# EAGLE design ventmon_t0.4 (EAGLE 9.6.2)

## Sheet 1 of 2
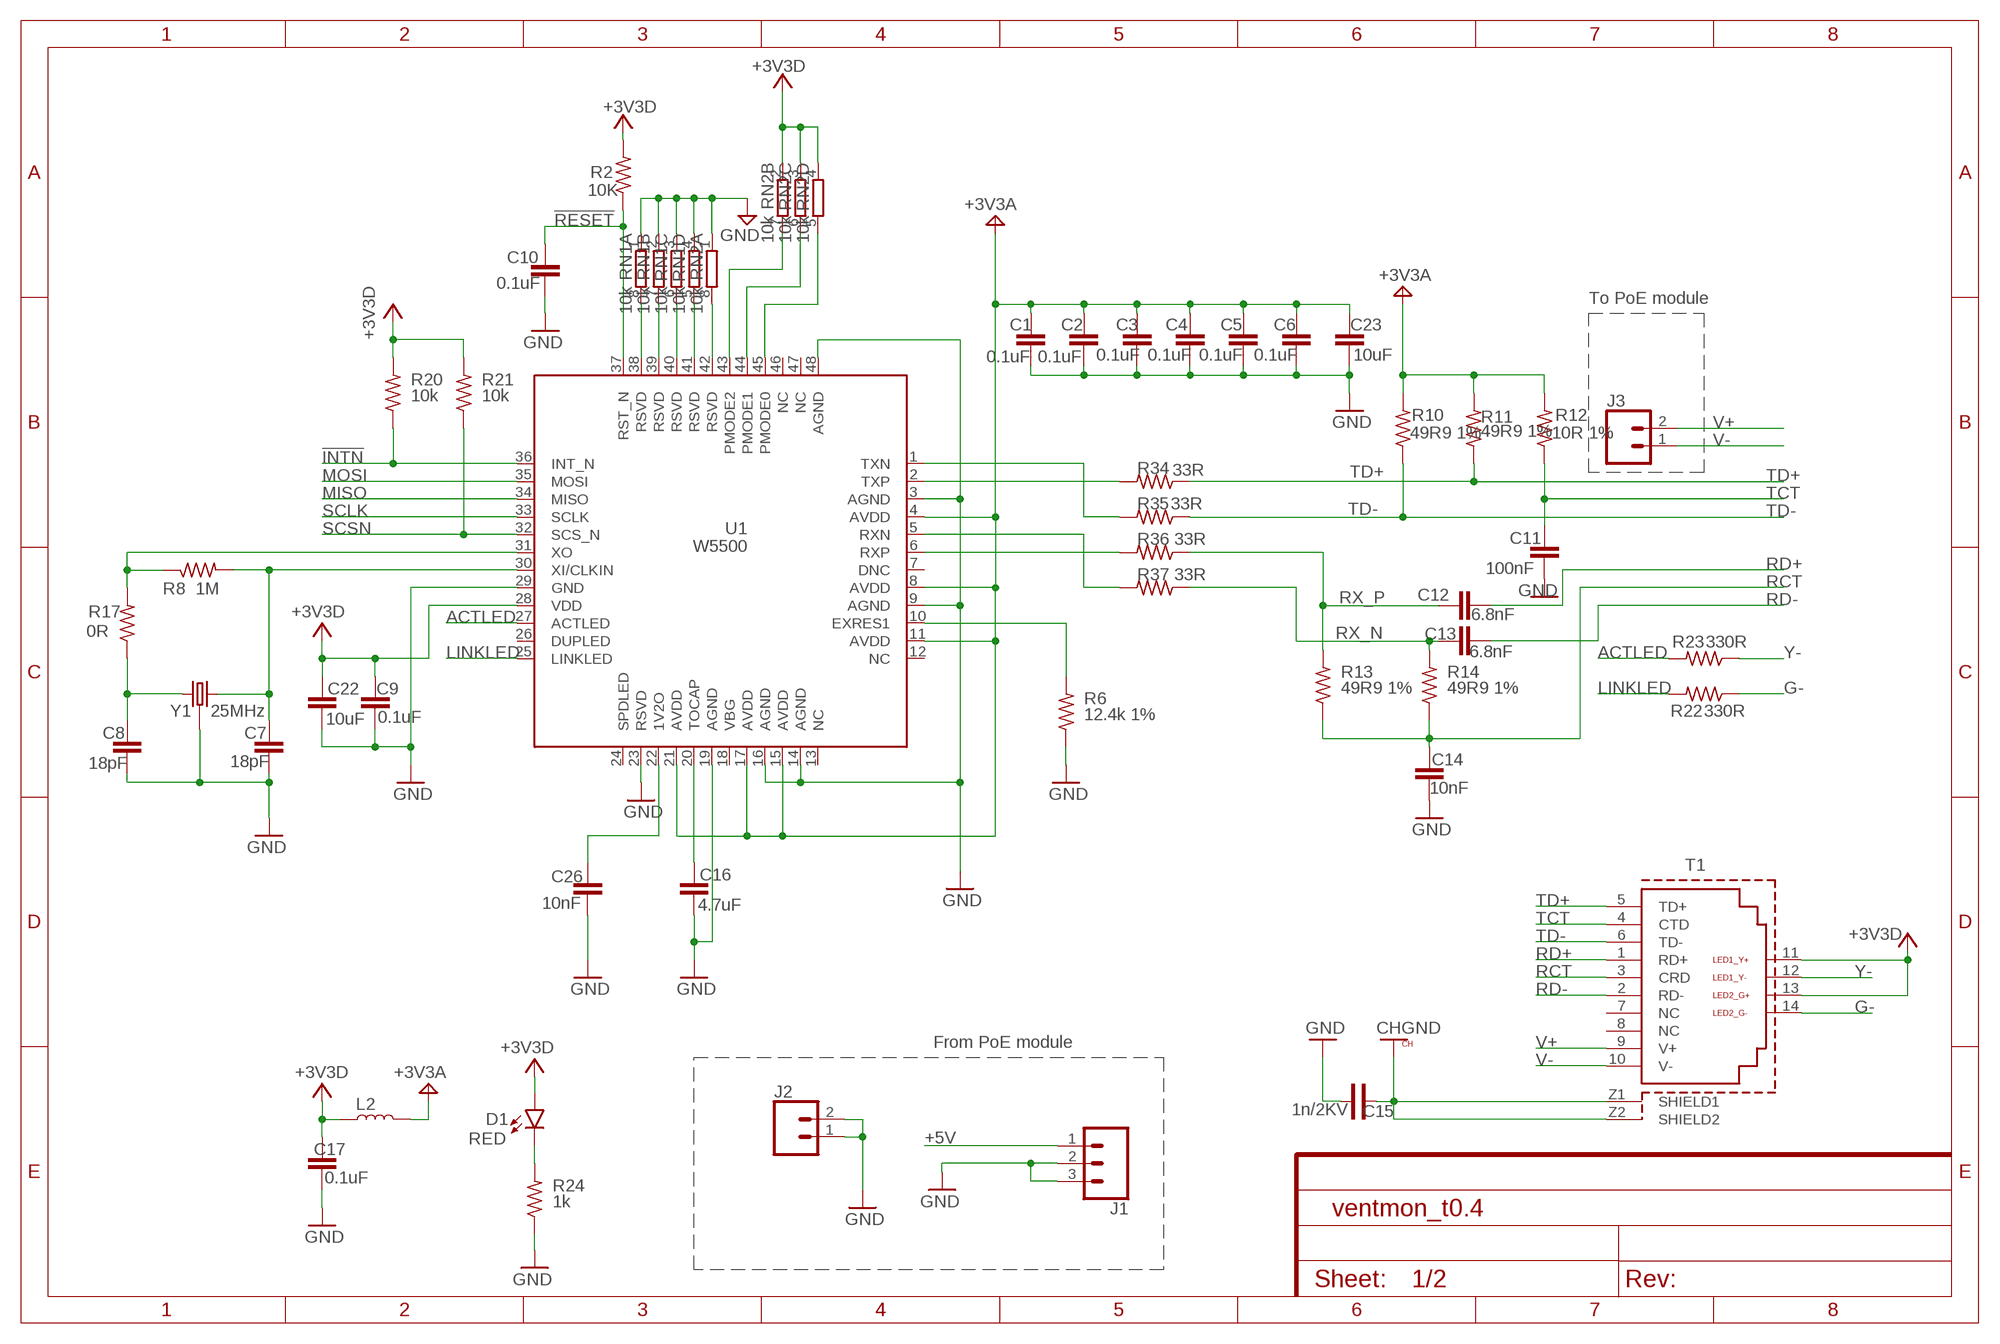
[diagram p0: schematic, sheet 1]

### Parts
C1  0.1uF  CAP_1  [C0402_B]
C2  0.1uF  CAP_1  [C0402_B]
C3  0.1uF  CAP_1  [C0402_B]
C4  0.1uF  CAP_1  [C0402_B]
C5  0.1uF  CAP_1  [C0402_B]
C6  0.1uF  CAP_1  [C0402_B]
C7  18pF  CAP_1  [C0402_B]
C8  18pF  CAP_1  [C0402_B]
C9  0.1uF  CAP_1  [C0402_B]
C10  0.1uF  CAP_1  [C0402_B]
C11  100nF  CAP_1  [C0402_B]
C12  6.8nF  CAP_1  [C0402_B]
C13  6.8nF  CAP_1  [C0402_B]
C14  10nF  CAP_1  [C0402_B]
C15  1n/2KV  C-1808  [C-1808]
C16  4.7uF  0.18UF-0603-10V-10%  [0603]
C17  0.1uF  CAP_1  [C0402_B]
C22  10uF  0.18UF-0603-10V-10%  [0603]
C23  10uF  0.18UF-0603-10V-10%  [0603]
C26  10nF  CAP_1  [C0402_B]
D1  RED  LED-RED0603  [LED-0603]
J1  CONN_03  [1X03]
J2  CONN_02  [1X02]
J3  CONN_02  [1X02]
L2  INDUCTOR-0805-3.3UH  [0805]
R2  10K  R-US_  [R0402_B]
R6  12.4k 1%  R-US_  [R0402_B]
R8  1M  R-US_  [R0402_B]
R10  49R9 1%  R-US_  [R0402_B]
R11  49R9 1%  R-US_  [R0402_B]
R12  10R 1%  R-US_  [R0402_B]
R13  49R9 1%  R-US_  [R0402_B]
R14  49R9 1%  R-US_  [R0402_B]
R17  0R  R-US_  [R0402_B]
R20  10k  R-US_  [R0402_B]
R21  10k  R-US_  [R0402_B]
R22  330R  R-US_  [R0402_B]
R23  330R  R-US_  [R0402_B]
R24  1k  R-US_  [R0402_B]
R34  33R  R-US_  [R0402_B]
R35  33R  R-US_  [R0402_B]
R36  33R  R-US_  [R0402_B]
R37  33R  R-US_  [R0402_B]
RN1  10k  4R-N0402ARV341  [4X0402ARV341]
RN2  10k  4R-N0402ARV341  [4X0402ARV341]
T1  WE-RJ45_7499210121A  [7499210121A]
U1  W5500  [W5500]
Y1  25MHz  CRYSTAL-GROUNDEDSMD-3.2X2.5  [CRYSTAL-SMD-3.2X2.5MM]

### Nets
!INTN: R20.1 U1.36(INT_N) ; also sheet 2
!RESET: C10.2 R2.1 U1.37(RST_N) ; also sheet 2
+3V3: C9.2 C17.2 C22.1 D1.A L2.1 R2.2 R20.2 R21.2 RN2.2 RN2.3 RN2.4 T1.11(LED1_Y+) T1.13(LED2_G+) U1.28(VDD) ; supply symbol labelled +3V3D ; also sheet 2
+3V3A: C1.2 C2.2 C3.2 C4.2 C5.2 C6.2 C23.1 L2.2 R10.2 R11.2 R12.2 U1.4(AVDD) U1.8(AVDD) U1.11(AVDD) U1.15(AVDD) U1.17(AVDD) U1.21(AVDD)
+5V: J1.1 ; also sheet 2
ACTLED: R23.2 U1.27(ACTLED)
CHGND: C15.P$1 T1.Z1(SHIELD1) T1.Z2(SHIELD2)
G-: R22.1 T1.14(LED2_G-)
GND: C1.1 C2.1 C3.1 C4.1 C5.1 C6.1 C7.1 C8.1 C9.1 C10.1 C11.1 C14.1 C15.P$2 C16.2 C17.1 C22.2 C23.2 C26.1 J1.2 J1.3 J2.1 J2.2 R6.1 R24.1 RN1.1 RN1.2 RN1.3 RN1.4 RN2.1 U1.3(AGND) U1.9(AGND) U1.14(AGND) U1.16(AGND) U1.19(AGND) U1.23(RSVD) U1.29(GND) U1.48(AGND) Y1.2 Y1.4 ; also sheet 2
LINKLED: R22.2 U1.25(LINKLED)
MISO: U1.34(MISO) ; also sheet 2
MOSI: U1.35(MOSI) ; also sheet 2
N$1: RN2.7 U1.43(PMODE2)
N$2: RN2.6 U1.44(PMODE1)
N$3: RN2.5 U1.45(PMODE0)
N$5: RN1.8 U1.38(RSVD)
N$6: RN1.7 U1.39(RSVD)
N$7: RN1.6 U1.40(RSVD)
N$8: RN1.5 U1.41(RSVD)
N$9: RN2.8 U1.42(RSVD)
N$11: C8.2 R17.1 Y1.1
N$12: C16.1 U1.20(TOCAP)
N$15: C26.2 U1.22(1V2O)
N$17: R6.2 U1.10(EXRES1)
N$20: D1.C R24.2
N$22: R8.1 R17.2 U1.31(XO)
N$29: C7.2 R8.2 U1.30(XI/CLKIN) Y1.3
R_N: R37.2 U1.5(RXN)
R_P: R36.2 U1.6(RXP)
RCT: C14.2 R13.1 R14.1 T1.3(CRD)
RD+: C12.2 T1.1(RD+)
RD-: C13.2 T1.2(RD-)
RX_N: C13.1 R14.2 R37.1
RX_P: C12.1 R13.2 R36.1
SCLK: U1.33(SCLK) ; also sheet 2
SCSN: R21.1 U1.32(SCS_N) ; also sheet 2
T_N: R35.2 U1.1(TXN)
T_P: R34.2 U1.2(TXP)
TCT: C11.2 R12.1 T1.4(CTD)
TD+: R11.1 R34.1 T1.5(TD+)
TD-: R10.1 R35.1 T1.6(TD-)
V+: J3.2 T1.9(V+)
V-: J3.1 T1.10(V-)
Y-: R23.1 T1.12(LED1_Y-)
Unconnected: T1.7(NC) T1.8(NC) U1.7(DNC) U1.12(NC) U1.13(NC) U1.18(VBG) U1.24(SPDLED) U1.26(DUPLED) U1.46(NC) U1.47(NC)

### Notes on the sheet
- To PoE module
- From PoE module

## Sheet 2 of 2
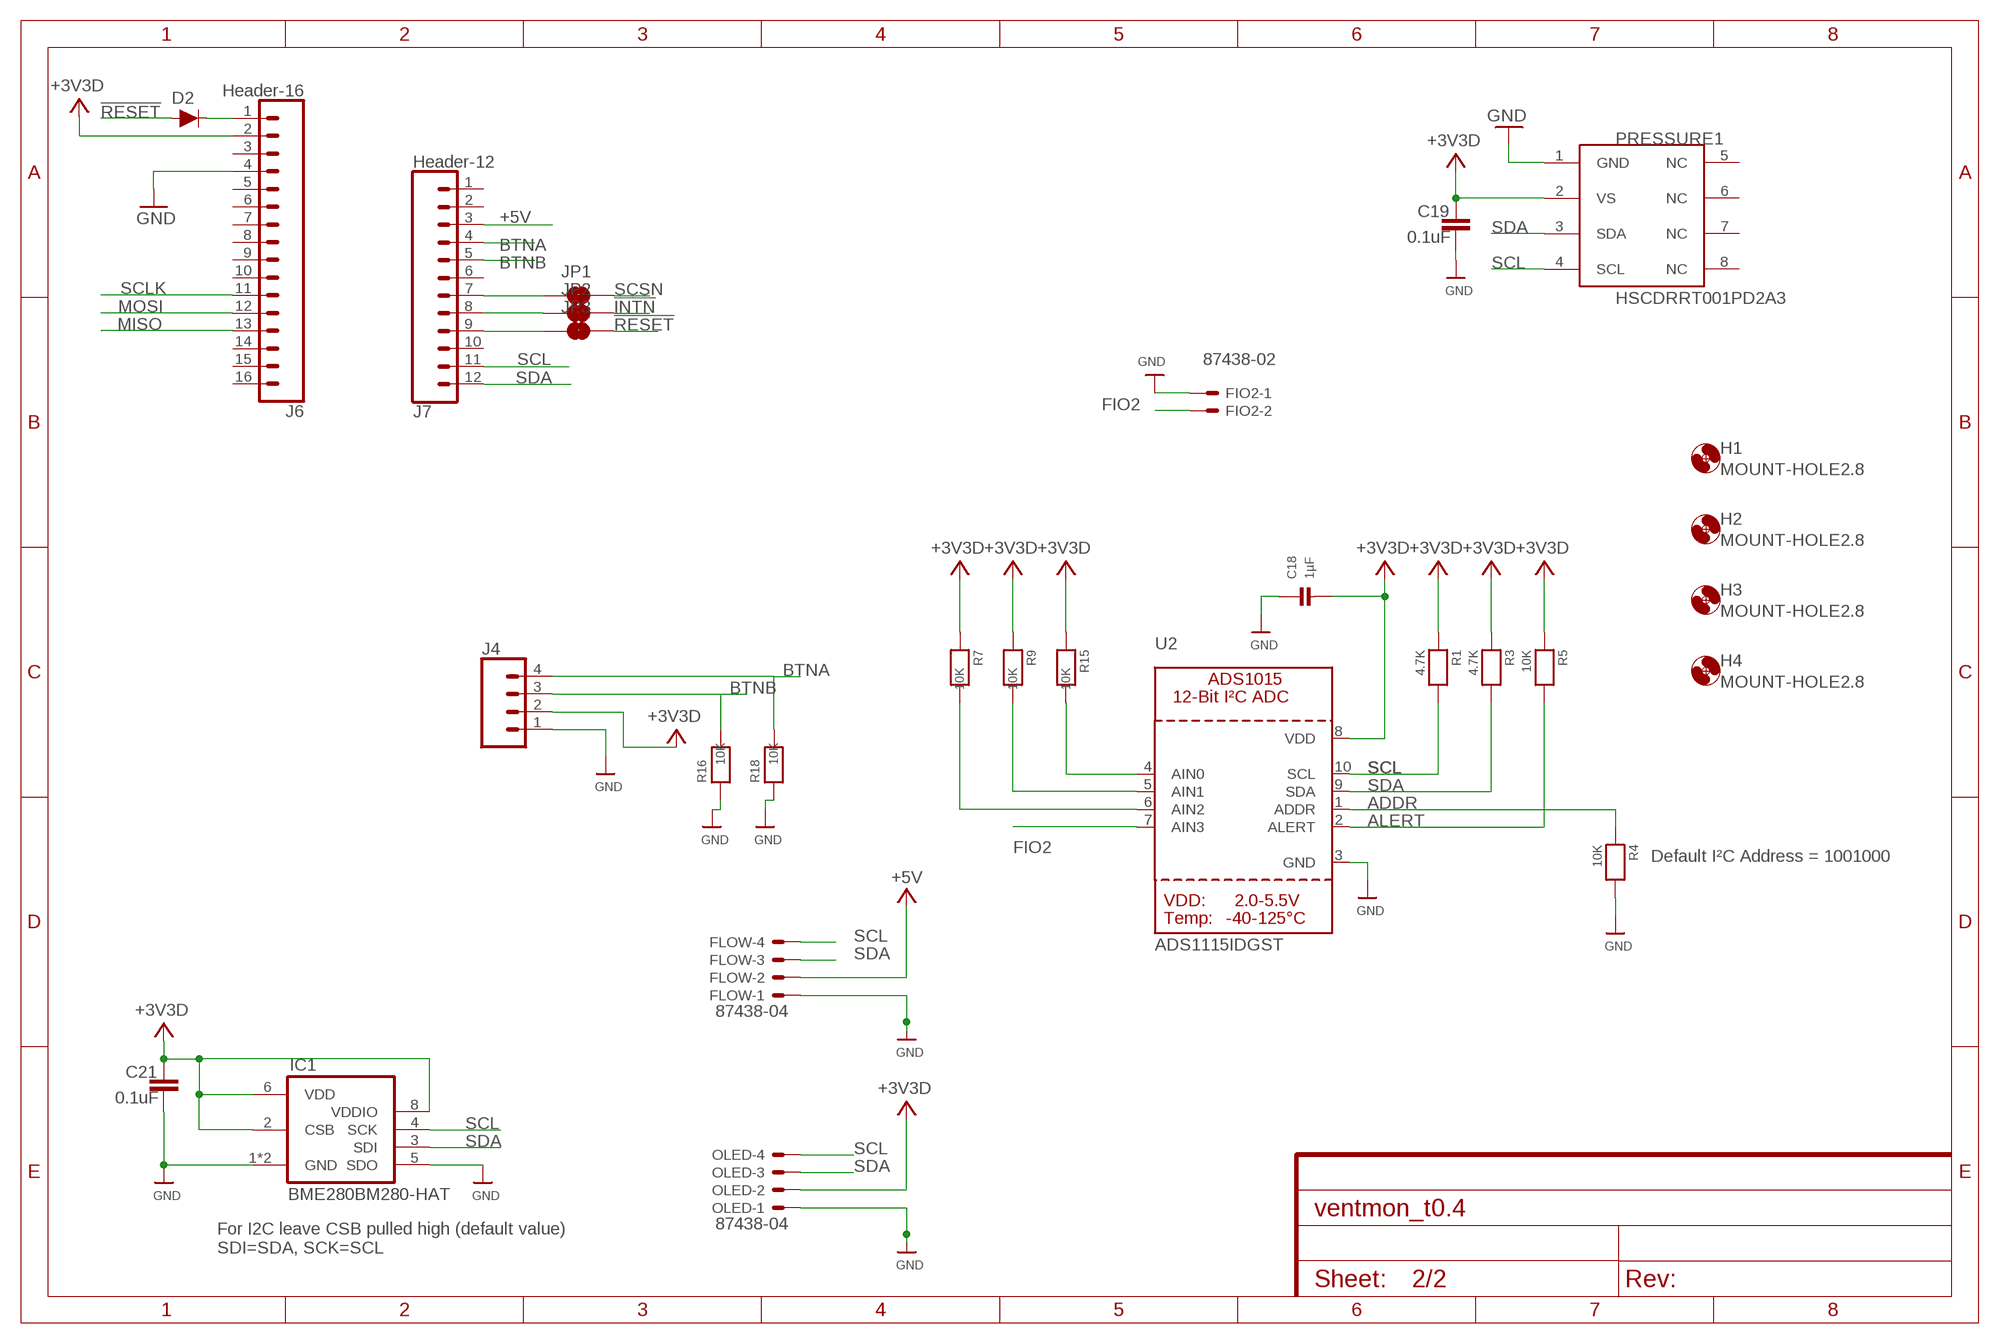
[diagram p1: schematic, sheet 2]

### Parts
C18  1µF  CAP_CERAMIC0805  [0805]
C19  0.1uF  CAP_1  [C0402_B]
C21  0.1uF  CAP_1  [C0402_B]
D2  DIODE-BAS16J  [SOD-323]
FIO2  87438-02  [87438-02]
FLOW  87438-04  [87438-04]
H1  MOUNT-HOLE2.8  [2,8]
H2  MOUNT-HOLE2.8  [2,8]
H3  MOUNT-HOLE2.8  [2,8]
H4  MOUNT-HOLE2.8  [2,8]
IC1  BME280BM280-HAT  [BME280-HAT]
J4  CONN_04POLAR  [MOLEX-1X4]
J6  Header-16  CONN_16  [1X16]
J7  Header-12  CONN_12  [1X12]
JP1  JUMPER-SMT_2_NC_TRACE_NO-SILK  [SMT-JUMPER_2_NC_TRACE_NO-SILK]
JP2  JUMPER-SMT_2_NC_TRACE_NO-SILK  [SMT-JUMPER_2_NC_TRACE_NO-SILK]
JP3  JUMPER-SMT_2_NC_TRACE_NO-SILK  [SMT-JUMPER_2_NC_TRACE_NO-SILK]
OLED  87438-04  [87438-04]
PRESSURE1  HSCDRRT001PD2A3  [DIP1330W46P254L1000H616Q8B]
R1  4.7K  RESISTOR0805  [0805]
R3  4.7K  RESISTOR0805  [0805]
R4  10K  RESISTOR0805  [0805]
R5  10K  RESISTOR0805  [0805]
R7  10K  RESISTOR0805  [0805]
R9  10K  RESISTOR0805  [0805]
R15  10K  RESISTOR0805  [0805]
R16  10K  RESISTOR0805  [0805]
R18  10K  RESISTOR0805  [0805]
U2  ADS1115IDGST  ADC_ADS1015  [MSOP10]

### Nets
!INTN: JP2.2 ; also sheet 1
!RESET: D2.A JP3.2 ; also sheet 1
+3V3: C18.2 C19.2 C21.2 IC1.2(CSB) IC1.6(VDD) IC1.8(VDDIO) J4.2 J6.2 OLED.2 PRESSURE1.2(VS) R1.1 R3.1 R5.1 R7.1 R9.1 R15.1 U2.8(VDD) ; supply symbol labelled +3V3D ; also sheet 1
+5V: FLOW.2 J7.3 ; also sheet 1
ADDR: R4.1 U2.1(ADDR)
ALERT: R5.2 U2.2(ALERT)
BTNA: J4.4 J7.4 R18.2
BTNB: J4.3 J7.5 R16.2
FIO2: FIO2.2 U2.7(AIN3)
GND: C18.1 C19.1 C21.1 FIO2.1 FLOW.1 IC1.1(GND) IC1.5(SDO) IC1.7(GND) J4.1 J6.4 OLED.1 PRESSURE1.1(GND) R4.2 R16.1 R18.1 U2.3(GND) ; also sheet 1
MISO: J6.13 ; also sheet 1
MOSI: J6.12 ; also sheet 1
N$4: D2.C J6.1
N$24: J7.7 JP1.1
N$25: J7.8 JP2.1
N$26: J7.9 JP3.1
N$38: R7.2 U2.6(AIN2)
N$40: R9.2 U2.5(AIN1)
N$45: R15.2 U2.4(AIN0)
SCL: FLOW.4 IC1.4(SCK) J7.11 OLED.4 PRESSURE1.4(SCL) R1.2 U2.10(SCL)
SCLK: J6.11 ; also sheet 1
SCSN: JP1.2 ; also sheet 1
SDA: FLOW.3 IC1.3(SDI) J7.12 OLED.3 PRESSURE1.3(SDA) R3.2 U2.9(SDA)
Unconnected: J6.3 J6.5 J6.6 J6.7 J6.8 J6.9 J6.10 J6.14 J6.15 J6.16 J7.1 J7.2 J7.6 J7.10 PRESSURE1.5(NC) PRESSURE1.6(NC) PRESSURE1.7(NC) PRESSURE1.8(NC)

### Notes on the sheet
- Default I²C Address = 1001000
- For I2C leave CSB pulled high (default value)
  SDI=SDA, SCK=SCL

## Library data of the parts
C1-C14 C17 C19 C21 C26 = Particle:CAP_1
C15 = CAP:C-1808
C16 C22 C23 = SparkFun-Capacitors:0.18UF: 0.18µF ceramic capacitor A capacitor is a passive two-terminal electrical component used to store electrical energy temporarily in an electric field.; PROD_ID: CAP-12380; VALUE: 0.18uF
C18 = microbuilder:CAP_CERAMIC: Ceramic Capacitors 0402 - 0402 Surface Mount Capacitors 16pF 50V 5% [Digikey: 445-4899-2-ND] 18pF 50V 5% [Digikey: 490-1281-2-ND] 22pF 50V 5% [Digikey: 490-1283-2-ND] 68pF 50V 5% [Digikey: 490-1289-2-ND] 0.1uF 10V 10% [Digikey: 490-1318-2-ND] 1.0uF 6.3V 10% [Digikey: 490-1320-2-ND] 0603 - 0603 Surface Mount Capacitors 16 pF 50V 5% [Digikey: 445-5051-2-ND] 22 pF 50V [Digikey: PCC220ACVTR-ND] 33 pF 50V 5% [Digikey: 490-1415-1-ND] 56pF 50V 5% [Digikey: 490-1421-1-ND] 220pF 50V 5% [Digikey: 445-1285-1-ND] 680 pF 50V 2200 pF 50V 5% C0G [Digikey: 445-1297-1-ND] 5600 pF 100V 5% X7R [Digikey: 478-3711-1-ND] 0.1 µF 25V 10% [Digikey: PCC2277TR-ND] 0.22 µF 16V 10% X7R [Digikey: 445-1318-1-ND] 1.0 µF 25V 10% [Digikey: 445-5146-2-ND] 0603 - RF Specific 3pF 250V +/-0.1pF RF [Digikey: 712-1347-1-ND] 18 pF 250V 5% [Digikey: 478-3505-1-ND or 712-1322-1-ND] 56 pF 250V 5% C0G RF [Digikey: 490-4867-1-ND] 68 pF 250V RF [Digikey: 490-4868-1-ND] 0805 - 0805 Surface Mount Capacitors 220 pF 250V 2% RF Ceramic Capacitor [Digikey: 712-1398-1-ND] 1000 pF 50V 2% NP0 Ceramic Capacitor [Digikey: 478-3760-1-ND] 0.1 µF 25V 10% Ceramic Capacitor [Digikey: PCC1828TR-ND] 1.0 µF 16V 10% Ceramic Capacitor[Digikey: 490-1691-2-ND] 10.0 µF 10V 10% Ceramic Capacitor[Digikey: 709-1228-1-ND] 10.0 uF 16V 10% Ceramic Capacitor [Digikey: 478-5165-2-ND] 47 uF 6.3V 20% Ceramic Capacitor [Digikey: 587-1779-1-ND or 399-5506-1-ND] 1206 - 1206 Surface Mount Capacitors 47uF 10V 20% Ceramic Capacitor [Digikey: 490-5528-1-ND or 399-5508-1-ND or 445-6010-1-ND] 100uF 6.3V -20%, +80% Y5V Ceramic Capacitor (Digikey: 490-4512-1-ND, Mouser: 81-GRM31CF50J107ZE1L)
D1 = SparkFun-LED:LED-RED: Red SMD LED Used in manufacturing of most products at SparkFun Packages: 0603 - SMD 0603 package [Product Link] <http://docs.avagotech.com/docs/AV02-0551EN> 0603 SMART - SMD 0603 SMART package ( more efficient and expensive)[Product Link] <http://www.osram-os.com/Graphics/XPic2/00077099_0.pdf> 1206 - SMD1206 package [Product Link] <https://www.sparkfun.com/datasheets/DevTools/LilyPad/Q150OVS4.pdff> SparkFun Products: Pro Mini 328 -5V <https://www.sparkfun.com/products/821> RedBoard <https://www.sparkfun.com/products/12757> IOIO-OTG <https://www.sparkfun.com/products/13613>; PROD_ID: DIO-00819
D2 = SparkFun-DiscreteSemi:DIODE: Diode These are standard reverse protection diodes and small signal diodes. SparkFun Products: SparkFun SparkPunk Sound Kit <https://www.sparkfun.com/products/11177> SparkFun ESP8266 Thing <https://www.sparkfun.com/products/13231>; PROD_ID: DIO-09646; VALUE: 250mA/100V
FIO2 = con-molex:87438-02: Wire-to-Board 1.50mm (.059") Pitch Header - Right Angle, SMT, Shrouded Source: http://www.molex.com/product/micro/87438.html; MF: MOLEX; OC_FARNELL: 1711327; OC_NEWARK: unknown
FLOW OLED = con-molex:87438-04: Wire-to-Board 1.50mm (.059") Pitch Header - Right Angle, SMT, Shrouded Source: http://www.molex.com/product/micro/87438.html; MF: MOLEX; OC_FARNELL: unknown; OC_NEWARK: unknown
H1-H4 = holes:MOUNT-HOLE: MOUNTING HOLE with drill center marker
IC1 = bosch-bme280:BME280: DIGITAL HUMIDITY, PRESSURE AND TEMPERATURE SENSOR * Digital interface I²C (up to 3.4 MHz) and SPI (3 and 4 wire, up to 10 MHz)* Supply voltage VDD main supply voltage range: 1.71 V to 3.6 V*VDDIO interface voltage range: 1.2 V to 3.6 V Operating range -40…+85 °C, 0…100 % rel. humidity, 300…1100 hPa The library has been designed by Richard Magdycz <https://www.facebook.com/groups/eaglecadsoftUK>
J1 = SparkFun-Connectors:CONN_03: Multi connection point. Often used as Generic Header-pin footprint for 0.1 inch spaced/style header connections On any of the 0.1 inch spaced packages, you can populate with these: Break Away Headers - Straight <https://www.sparkfun.com/products/116> (PRT-00116) Break Away Male Headers - Right Angle <https://www.sparkfun.com/products/553> (PRT-00553) Female Headers <https://www.sparkfun.com/products/115> (PRT-00115) Break Away Headers - Machine Pin <https://www.sparkfun.com/products/117> (PRT-00117) Break Away Female Headers - Swiss Machine Pin <https://www.sparkfun.com/products/743> (PRT-00743) Stackable Header - 3 Pin (Female, 0.1") <https://www.sparkfun.com/products/13875> (PRT-13875) For SCREWTERMINALS and SPRING TERMINALS visit here: Screw Terimnals on SparkFun.com <https://www.sparkfun.com/search/results?term=Screw+Terminals> (5mm/3.5mm/2.54mm spacing) This device is also useful as a general connection point to wire up your design to another part of your project. Our various solder wires solder well into these plated through hole pads. Hook-Up Wire - Assortment (Stranded, 22 AWG) <https://www.sparkfun.com/products/11375> (PRT-11375) Hook-Up Wire - Assortment (Solid Core, 22 AWG) <https://www.sparkfun.com/products/11367> (PRT-11367) View the entire wire category on our website here <https://www.sparkfun.com/categories/141> Special notes: Molex polarized connector foot print use with SKU : PRT-08232 with associated crimp pins and housings.
J2 J3 = SparkFun-Connectors:CONN_02: Multi connection point. Often used as Generic Header-pin footprint for 0.1 inch spaced/style header connections On any of the 0.1 inch spaced packages, you can populate with these: Break Away Headers - Straight <https://www.sparkfun.com/products/116> (PRT-00116) Break Away Male Headers - Right Angle <https://www.sparkfun.com/products/553> (PRT-00553) Female Headers <https://www.sparkfun.com/products/115> (PRT-00115) Break Away Headers - Machine Pin <https://www.sparkfun.com/products/117> (PRT-00117) Break Away Female Headers - Swiss Machine Pin <https://www.sparkfun.com/products/743> (PRT-00743) For SCREWTERMINALS and SPRING TERMINALS visit here: Screw Terimnals on SparkFun.com <https://www.sparkfun.com/search/results?term=Screw+Terminals> (5mm/3.5mm/2.54mm spacing) This device is also useful as a general connection point to wire up your design to another part of your project. Our various solder wires solder well into these plated through hole pads. Hook-Up Wire - Assortment (Stranded, 22 AWG) <https://www.sparkfun.com/products/11375> (PRT-11375) Hook-Up Wire - Assortment (Solid Core, 22 AWG) <https://www.sparkfun.com/products/11367> (PRT-11367) View the entire wire category on our website here <https://www.sparkfun.com/categories/141> Special notes: Molex polarized connector foot print use with: PRT-08233 with associated crimp pins and housings. 2.54_SCREWTERM for use with PRT-10571. 3.5mm Screw Terminal footprints for PRT-08084 5mm Screw Terminal footprints for use with PRT-08432
J4 = SparkFun-Connectors:CONN_04: Multi connection point. Often used as Generic Header-pin footprint for 0.1 inch spaced/style header connections On any of the 0.1 inch spaced packages, you can populate with these: Break Away Headers - Straight <https://www.sparkfun.com/products/116> (PRT-00116) Break Away Male Headers - Right Angle <https://www.sparkfun.com/products/553> (PRT-00553) Female Headers <https://www.sparkfun.com/products/115> (PRT-00115) Break Away Headers - Machine Pin <https://www.sparkfun.com/products/117> (PRT-00117) Break Away Female Headers - Swiss Machine Pin <https://www.sparkfun.com/products/743> (PRT-00743) For SCREWTERMINALS and SPRING TERMINALS visit here: Screw Terimnals on SparkFun.com <https://www.sparkfun.com/search/results?term=Screw+Terminals> (5mm/3.5mm/2.54mm spacing) This device is also useful as a general connection point to wire up your design to another part of your project. Our various solder wires solder well into these plated through hole pads. Hook-Up Wire - Assortment (Stranded, 22 AWG) <https://www.sparkfun.com/products/11375> (PRT-11375) Hook-Up Wire - Assortment (Solid Core, 22 AWG) <https://www.sparkfun.com/products/11367> (PRT-11367) View the entire wire category on our website here <https://www.sparkfun.com/categories/141> Special notes: Molex polarized connector foot print use with SKU : PRT-08231 with associated crimp pins and housings. 1MM SMD Version SKU: PRT-10208; PROD_ID: CONN-08186; SF_ID: PRT-08231
J6 = SparkFun-Connectors:CONN_16: Multi connection point. Often used as Generic Header-pin footprint for 0.1 inch spaced/style header connections On any of the 0.1 inch spaced packages, you can populate with these: Break Away Headers - Straight <https://www.sparkfun.com/products/116> (PRT-00116) Break Away Male Headers - Right Angle <https://www.sparkfun.com/products/553> (PRT-00553) Female Headers <https://www.sparkfun.com/products/115> (PRT-00115) Break Away Headers - Machine Pin <https://www.sparkfun.com/products/117> (PRT-00117) Break Away Female Headers - Swiss Machine Pin <https://www.sparkfun.com/products/743> (PRT-00743) For SCREWTERMINALS and SPRING TERMINALS visit here: Screw Terimnals on SparkFun.com <https://www.sparkfun.com/search/results?term=Screw+Terminals> (5mm/3.5mm/2.54mm spacing) This device is also useful as a general connection point to wire up your design to another part of your project. Our various solder wires solder well into these plated through hole pads. Hook-Up Wire - Assortment (Stranded, 22 AWG) <https://www.sparkfun.com/products/11375> (PRT-11375) Hook-Up Wire - Assortment (Solid Core, 22 AWG) <https://www.sparkfun.com/products/11367> (PRT-11367) View the entire wire category on our website here <https://www.sparkfun.com/categories/141> Special notes: Molex polarized connector foot print use with SKU : PRT-08231 with associated crimp pins and housings. 1MM SMD Version SKU: PRT-10208 NOTES ON THE VARIANTS LOCK and LOCK_LONGPADS... This footprint was designed to help hold the alignment of a through-hole component (i.e. 6-pin header) while soldering it into place. You may notice that each hole has been shifted either up or down by 0.005 of an inch from it's more standard position (which is a perfectly straight line). This slight alteration caused the pins (the squares in the middle) to touch the edges of the holes. Because they are alternating, it causes a "brace" to hold the component in place. 0.005 has proven to be the perfect amount of "off-center" position when using our standard breakaway headers. Although looks a little odd when you look at the bare footprint, once you have a header in there, the alteration is very hard to notice. Also,if you push a header all the way into place, it is covered up entirely on the bottom side.
J7 = SparkFun-Connectors:CONN_12: Multi connection point. Often used as Generic Header-pin footprint for 0.1 inch spaced/style header connections On any of the 0.1 inch spaced packages, you can populate with these: Break Away Headers - Straight <https://www.sparkfun.com/products/116> (PRT-00116) Break Away Male Headers - Right Angle <https://www.sparkfun.com/products/553> (PRT-00553) Female Headers <https://www.sparkfun.com/products/115> (PRT-00115) Break Away Headers - Machine Pin <https://www.sparkfun.com/products/117> (PRT-00117) Break Away Female Headers - Swiss Machine Pin <https://www.sparkfun.com/products/743> (PRT-00743) For SCREWTERMINALS and SPRING TERMINALS visit here: Screw Terimnals on SparkFun.com <https://www.sparkfun.com/search/results?term=Screw+Terminals> (5mm/3.5mm/2.54mm spacing) This device is also useful as a general connection point to wire up your design to another part of your project. Our various solder wires solder well into these plated through hole pads. Hook-Up Wire - Assortment (Stranded, 22 AWG) <https://www.sparkfun.com/products/11375> (PRT-11375) Hook-Up Wire - Assortment (Solid Core, 22 AWG) <https://www.sparkfun.com/products/11367> (PRT-11367) View the entire wire category on our website here <https://www.sparkfun.com/categories/141> Special notes: Molex polarized connector foot print use with SKU : PRT-08231 with associated crimp pins and housings. 1MM SMD Version SKU: PRT-10208 NOTES ON THE VARIANTS LOCK and LOCK_LONGPADS... This footprint was designed to help hold the alignment of a through-hole component (i.e. 6-pin header) while soldering it into place. You may notice that each hole has been shifted either up or down by 0.005 of an inch from it's more standard position (which is a perfectly straight line). This slight alteration caused the pins (the squares in the middle) to touch the edges of the holes. Because they are alternating, it causes a "brace" to hold the component in place. 0.005 has proven to be the perfect amount of "off-center" position when using our standard breakaway headers. Although looks a little odd when you look at the bare footprint, once you have a header in there, the alteration is very hard to notice. Also,if you push a header all the way into place, it is covered up entirely on the bottom side.
JP1-JP3 = SparkFun-Jumpers:JUMPER-SMT_2_NC_TRACE: Normally closed trace jumper This jumper has a trace between two pads so it's normally closed (NC). Use a razor knife to open the connection. For best results follow the IPC guidelines for cutting traces: Cutout at least 0.063 mm (0.005 in). Remove all loose material to clean up the cut area. Seal the cut with an approved epoxy. Reapply solder to reclose the connection.
L2 = SparkFun-Coils:INDUCTOR: Inductors Resist changes in electrical current. Basically a coil of wire. SparkFun Products: SparkFun Load Cell Amplifier - HX711 <https://www.sparkfun.com/products/13879> IOIO-OTG - V2.2 <https://www.sparkfun.com/products/13613>; PROD_ID: NDUC-13076; VALUE: 3.3µH/±20%/450mA
PRESSURE1 = HSCDRRT001PD2A3:HSCDRRT001PD2A3: Honeywell Differential Pressure Sensor Pressure Sensor ±1PSI (±6.89kPa) Differential Male - 0.08" (1.93mm) Tube, Dual 12 b 8-DIP (0.524", 13.30mm), Dual Ports, Same Side, I2C https://www.digikey.com/product-detail/en/honeywell-sensing-and-productivity-solutions/HSCDRRT001PD2A3/480-3335-ND/2601662
R1 R3-R5 R7 R9 R15 R16 R18 = microbuilder:RESISTOR: Resistors 0402 - 0402 Surface Mount Package 22 Ohm 1% 1/16W [Digikey: 311-22.0LRTR-ND] 33 Ohm 5% 1/16W 1.0K 5% 1/16W 1.5K 5% 1/16W 2.0K 1% 1/16W 10.0K 1% 1/16W [Digikey: 311-10.0KLRTR-ND] 10.0K 5% 1/16W [Digikey: RMCF0402JT10K0TR-ND] 12.1K 1% 1/16W [Digikey: 311-22.0LRTR-ND] 100.0K 5% 1/16W 0603 - 0603 Surface Mount Package 0 Ohm 1/10 Watt 1% Resistor 15 Ohm 1/10 Watt 1% Resistor 33 Ohm 1/10 Watt 1% Resistor 49.9 Ohm 1/10 Watt 1% Resistor 100 Ohm 1/10 Watt 1% Resistor 150 Ohm 1/10 Watt 1% Resistor 240 Ohm 1/10 Watt 1% Resistor 390 Ohm 1/10 Watt 1% Resistor 560 Ohm 1/10 Watt 1% Resistor 680 Ohm 1/10 Watt 1% Resistor 750 Ohm 1/10 Watt 1% Resistor 1.0K Ohm 1/10 Watt 1% Resistor 1.5K Ohm 1/10 Watt 1% Resistor 2.0K Ohm 1/10 Watt 1% Resistor 2.2K Ohm 1/10 Watt 1% Resistor 3.3K Ohm 1/10 Watt 1% Resistor 4.7K Ohm 1/10 Watt 1% Resistor 10.0K Ohm 1/10 Watt 1% Resistor 12.0K Ohm 1/10 Watt 1% Resistor 12.1K Ohm 1/10 Watt 1% Resistor 20.0K Ohm 1/10 Watt 1% Resistor 33.0K Ohm 1/10 Watt 1% Resistor 100.0K Ohm 1/10 Watt 1% Resistor 0805 - 0805 Surface Mount Package 0 Ohm 1/8 Watt 1% Resistor 33 Ohm 1/8 Watt 1% Resistor 100 Ohm 1/8 Watt 1% Resistor 150 Ohm 1/8 Watt 1% Resistor 200 Ohm 1/8 Watt 1% Resistor 240 Ohm 1/8 Watt 1% Resistor 330 Ohm 1/8 Watt 1% Resistor 390 Ohm 1/8 Watt 1% Resistor 470 Ohm 1/8 Watt 1% Resistor 1.0K Ohm 1/8 Watt 1% Resistor 1.5K Ohm 1/8 Watt 1% Resistor 2.0K Ohm 1/8 Watt 1% Resistor 4.7K Ohm 1/8 Watt 1% Resistor 5.1K Ohm 1/8 Watt 1% Resistor 5.6K Ohm 1/8 Watt 1% Resistor 10.0K Ohm 1/8 Watt 1% Resistor 22.0K Ohm 1/8 Watt 1% Resistor 33.0K Ohm 1/8 Watt 1% Resistor 100K Ohm 1/8 Watt 1% Resistor 1206 - 1206 Surface Mount Package 2012 - 2010 Surface Mount Package 0.11 Ohm 1/2 Watt 1% Resistor - Digikey: RHM.11UCT-ND
R2 R6 R8 R10-R14 R17 R20-R24 R34-R37 = Particle:R-US_: 0402 Resistor
RN1 RN2 = resistor-dil:4R-N: Array Chip Resistor Source: RS Component / Phycomp; OC_FARNELL: unknown; OC_NEWARK: unknown
T1 = Wurth_Signal & Communications_WE-RJ45_LAN:WE-RJ45_7499210121A: WE-RJ45 LAN Transformer Characteristics RJ45 Connector with integrated transformer / common mode choke Power over Ethernet up to 50 Watt and speeds up to 10 Gbit/s Available in SMD, THT and THT with USB Compliant with standards: IEEE 802.3u, IEEE 802.3ab, IEEE 802.3af, IEEE 802.3at, IEEE 802.3an and upcoming IEE 802.3bt Applications Suitable for industrial temperatures from –40 °C up to +85 °C Compatible to Industrial Ethernet systems like EtherCAT or Profinet Compliant with most IC’s for Ethernet applications such as Microchip, Texas Instruments, Broadcom, Linear Technology Hubs, Routers, Switches, IP cameras, IoT applications <https://katalog.we-online.com/media/images/v2/o35731v209%20Family_WE-RJ45-LAN.jpg> Details see: https://katalog.we-online.com/en/pbs/WE-LAN-RJ45 Updated by Ella Wu 2019-08-05 2019 (C) Wurth Elektronik; DATA-RATE: 10/100 Base-T; DATASHEET-URL: https://www.we-online.com/catalog/datasheet/7499210121A.pdf; LED: yellow-green; MOUNT: THT; PART-NUMBER: 7499210121A; POE: PoE (up to 350 mA); PORTS: 1; USB: No
U1 = W5500_Ethernet_shield_v10:W5500
U2 = microbuilder:ADC_ADS1015: ADS1015 - 12-bit 4-Channel I2C ADC with Internal PGA VDD: 2.0-5.5V Sampling Rate: 3.3ksps Gain Settings: 2/3, 1, 2, 4, 8, 16 I2C Address: ADDR low = 1001000x, ADDR high = 1001001x Internal Comparator The ADS1015 includes an internal comparator that can be set to output a high-level on ALERT when the conversion results exceeeds a pre-defined upper level, and will deassert itself when the level falls below a pre-defined lower threshold level. It can also be set to windowed mode where the ALERT pin will be asserted if the data exceeds the upper threshold or falls below the lower threshold.
Y1 = SparkFun-Clocks:CRYSTAL-GROUNDED: Crystals w/ Ground Pin (Generic) These are passive quartz crystals, which can be used as a clock source for a microcontroller. Crystal's are usually two-terminal devices. A third terminal may be optionally connected to ground, as recommended by the manufaturer.

## Board
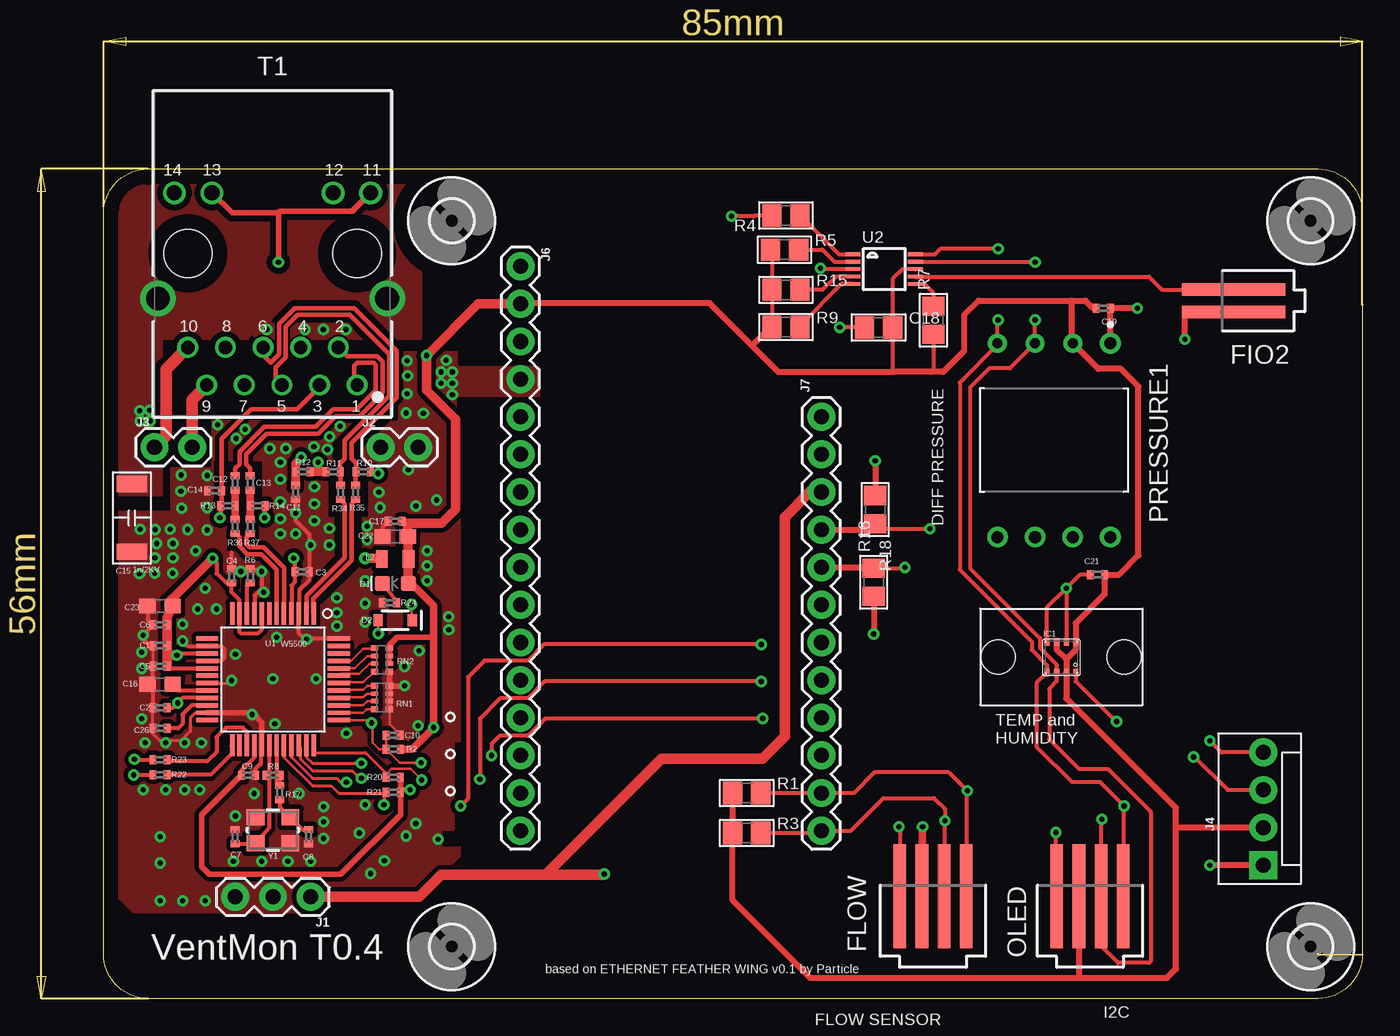
[diagram p2: board, top side]
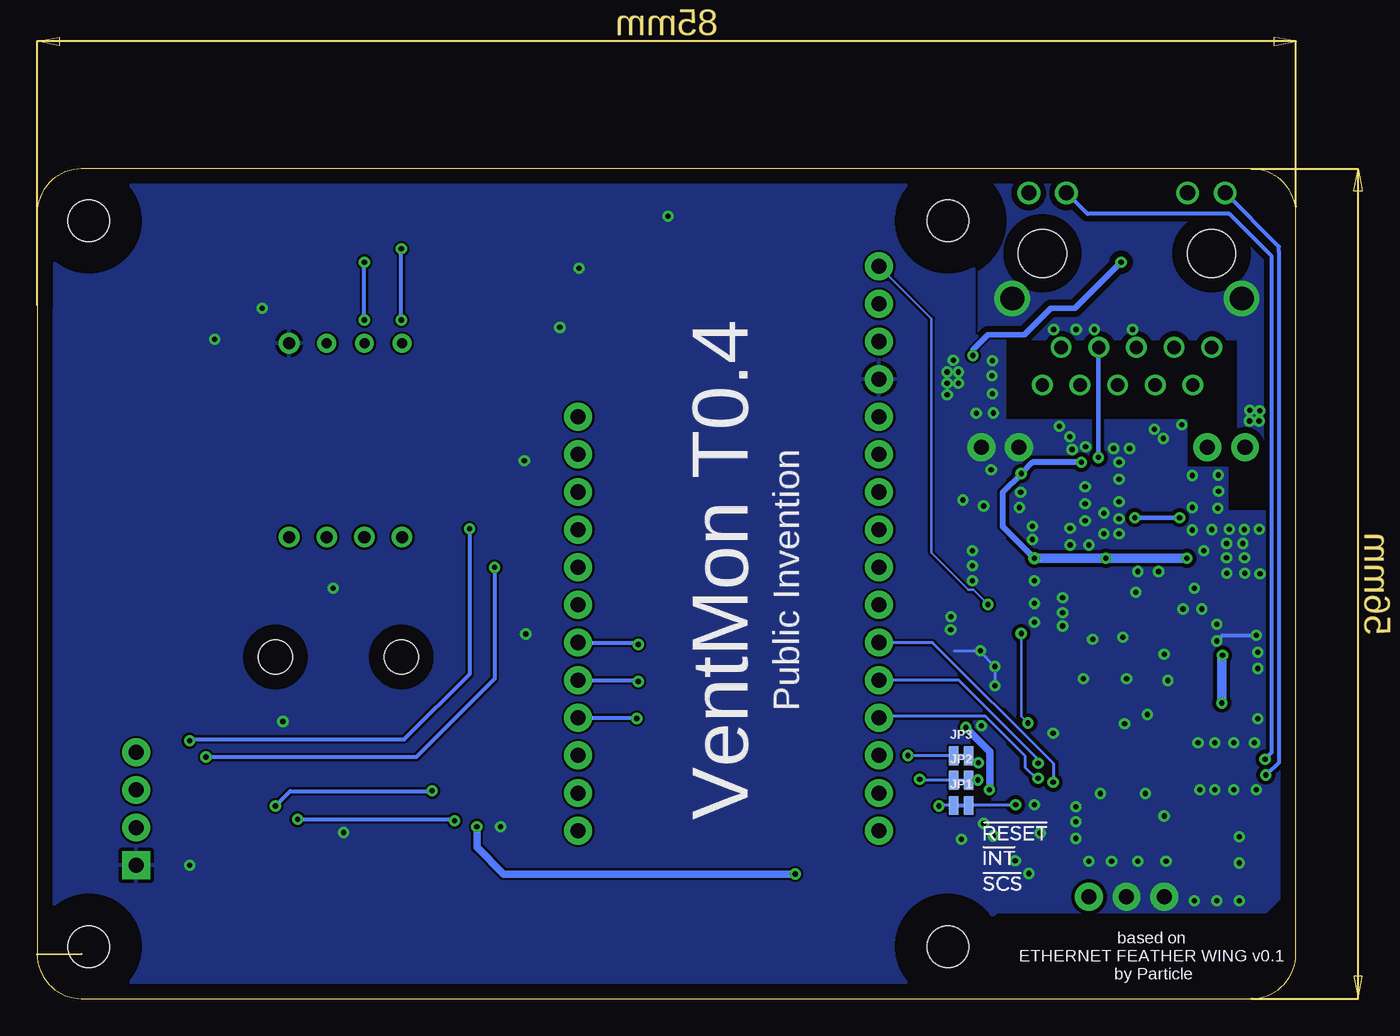
[diagram p3: board, bottom side, seen from below]

Size 85 x 56 mm. Coordinates in mm from the lower left corner, seen from the top.
Outline: 0,3 0,53 arc-90 3,56 82,56 arc-90 85,53 85,3 arc-90 82,0 3,0 arc-90 0,3
Copper layers (1*16): Top 0.035mm / dielectric 1.5mm / Bottom 0.035mm
Design rules "default *": minimum track width 6mil, minimum drill 10mil, track to track 6mil, track to pad 6mil, pad to pad 6mil, via to via 6mil, smd to smd 6mil, copper to edge 40mil, drill to drill 6mil, minimum pad ring 10mil, minimum via ring 8mil, stop-mask expansion 4mil, vias tented up to drill 0.35mm, thermal gap 10mil

### Footprints (pad centres in the part's own frame; a part is rotated, then mirrored left to right if it is on the bottom)
C0402_B = smd 0.457 x 0.61: 1 -0.483,0; 2 0.483,0
C-1808 = smd 1.1 x 2.05: P$1 -2.285,0; P$2 2.285,0
0603 = smd 1.1 x 1: 1 -0.85,0; 2 0.85,0
0805 = smd 1.3 x 1.5: 1 -0.95,0; 2 0.95,0
LED-0603 = smd 1 x 1: A -0.877,0; C 0.877,0
SOD-323 = smd 0.63 x 0.83: A 1.15,0; C -1.15,0
87438-02 = smd 7 x 0.85: 1 0,0.75; 2 0,-0.75
87438-04 = smd 7 x 0.85: 1 0,2.25; 2 0,0.75; 3 0,-0.75; 4 0,-2.25
2,8 = hole 2.8: 0,0
BME280-HAT = smd 0.35 x 0.5: 1 2.245,-2.295; 2 1.595,-2.295; 3 0.945,-2.295; 4 0.295,-2.295; 5 0.295,-0.245; 6 0.945,-0.245; 7 1.595,-0.245; 8 2.245,-0.245 | hole 2.3: 5.5,-1.25; -3,-1.25
1X03 = drill 1.016 pad 1.88: 1 0,0; 2 2.54,0; 3 5.08,0
1X02 = drill 1.016 pad 1.88: 1 0,0; 2 2.54,0
MOLEX-1X4 = drill 1.016 pad 1.88 square: 1 0,0 | drill 1.016 pad 1.88: 2 2.54,0; 3 5.08,0; 4 7.62,0
1X16 = drill 1.016 pad 1.88: 1 0,0; 2 2.54,0; 3 5.08,0; 4 7.62,0; 5 10.16,0; 6 12.7,0; 7 15.24,0; 8 17.78,0; 9 20.32,0; 10 22.86,0; 11 25.4,0; 12 27.94,0; 13 30.48,0; 14 33.02,0; 15 35.56,0; 16 38.1,0
1X12 = drill 1.016 pad 1.88: 1 0,0; 2 2.54,0; 3 5.08,0; 4 7.62,0; 5 10.16,0; 6 12.7,0; 7 15.24,0; 8 17.78,0; 9 20.32,0; 10 22.86,0; 11 25.4,0; 12 27.94,0
SMT-JUMPER_2_NC_TRACE_NO-SILK = smd 0.635 x 1.27: 1 -0.508,0; 2 0.508,0
0805' = smd 0.8 x 1.2: 1 -0.9,0; 2 0.9,0
DIP1330W46P254L1000H616Q8B = drill 0.813 pad 1.397: 1 -6.54,3.81; 5 6.54,-3.81; 6 6.54,-1.27; 7 6.54,1.27; 8 6.54,3.81 | drill 0.675 pad 1.275: 2 -6.54,1.27; 3 -6.54,-1.27; 4 -6.54,-3.81
R0402_B = smd 0.457 x 0.61: 1 -0.483,0; 2 0.483,0
4X0402ARV341 = smd 0.4 x 0.5: 1 -0.8,-0.5; 4 0.8,-0.5; 5 0.8,0.5; 8 -0.8,0.5 | smd 0.3 x 0.5: 2 -0.25,-0.5; 3 0.25,-0.5; 6 0.25,0.5; 7 -0.25,0.5
7499210121A = drill 0.9: 1 5.715,-8.89; 2 4.445,-6.35; 3 3.175,-8.89; 4 1.905,-6.35; 5 0.635,-8.89; 6 -0.635,-6.35; 7 -1.905,-8.89; 8 -3.175,-6.35; 9 -4.445,-8.89; 10 -5.715,-6.35 | drill 1.02: 11 6.63,4.08; 12 4.09,4.08; 13 -4.09,4.08; 14 -6.63,4.08 | drill 1.6: Z1 -7.745,-3.05; Z2 7.745,-3.05 | hole 3.25: 5.715,0; -5.715,0
W5500 = smd 1.5 x 0.3: 1 -4.45,2.75; 2 -4.45,2.25; 3 -4.45,1.75; 4 -4.45,1.25; 5 -4.45,0.75; 6 -4.45,0.25; 7 -4.45,-0.25; 8 -4.45,-0.75; 9 -4.45,-1.25; 10 -4.45,-1.75; 11 -4.45,-2.25; 12 -4.45,-2.75; 25 4.45,-2.75; 26 4.45,-2.25; 27 4.45,-1.75; 28 4.45,-1.25; 29 4.45,-0.75; 30 4.45,-0.25; 31 4.45,0.25; 32 4.45,0.75; 33 4.45,1.25; 34 4.45,1.75; 35 4.45,2.25; 36 4.45,2.75 | smd 0.3 x 1.5: 13 -2.75,-4.45; 14 -2.25,-4.45; 15 -1.75,-4.45; 16 -1.25,-4.45; 17 -0.75,-4.45; 18 -0.25,-4.45; 19 0.25,-4.45; 20 0.75,-4.45; 21 1.25,-4.45; 22 1.75,-4.45; 23 2.25,-4.45; 24 2.75,-4.45; 37 2.75,4.45; 38 2.25,4.45; 39 1.75,4.45; 40 1.25,4.45; 41 0.75,4.45; 42 0.25,4.45; 43 -0.25,4.45; 44 -0.75,4.45; 45 -1.25,4.45; 46 -1.75,4.45; 47 -2.25,4.45; 48 -2.75,4.45
MSOP10 = smd 0.25 x 1: 1 -1,-2.113; 2 -0.5,-2.113; 3 0,-2.113; 4 0.5,-2.113; 5 1,-2.113; 6 1,2.113; 7 0.5,2.113; 8 0,2.113; 9 -0.5,2.113; 10 -1,2.113
CRYSTAL-SMD-3.2X2.5MM = smd 1.2 x 1.1: 1 -1.175,-0.875; 2 1.175,-0.875; 3 1.175,0.875; 4 -1.175,0.875

### Placement (x,y rotation side)
C1  3.81,23.83 0 top
C2  3.81,19.63 0 top
C3  13.41,28.8 180 top
C4  8.64,28.52 270 top
C5  3.81,22.43 0 top
C6  3.81,25.22 0 top
C7  8.89,10.92 270 top
C8  13.84,10.92 90 top
C9  9.78,15.06 180 top
C10  19.56,17.78 180 top
C11  12.95,34.16 90 top
C12  8.89,34.8 90 top
C13  9.91,34.8 90 top
C14  7.49,34.29 0 top
C15  1.91,32.44 270 top
C16  3.81,21.21 180 top
C17  19.68,32.21 0 top
C18  52.33,45.29 0 top
C19  67.5,46.6 180 top
C21  67.1,28.62 0 top
C22  19.68,31.19 180 top
C23  3.81,26.49 180 top
C26  3.81,18.24 0 top
D1  19.68,28.02 180 top
D2  19.68,25.53 180 top
FIO2  76.3,47.1 180 top
FLOW  56,6.9 90 top
H1  81.5,52.5 0 top
H2  81.5,3.5 0 top
H3  23.5,3.5 0 top
H4  23.5,52.5 0 top
IC1  63.4,24.3 0 top
J1  13.97,6.86 180 top
J2  18.7,37.21 0 top
J3  3.43,37.21 0 top
J4  78.3,9 90 top
J6  28.14,49.43 270 top
J7  48.46,39.27 270 top
JP1  22.61,13.03 0 bottom
JP2  22.61,14.73 0 bottom
JP3  22.61,16.38 0 bottom
L2  [0805']  19.68,29.67 180 top
OLED  66.6,6.9 90 top
PRESSURE1  64.17,37.69 270 top
R1  43.42,13.88 0 top
R2  19.56,16.84 0 top
R3  43.42,11.18 0 top
R4  46.07,52.86 180 top
R5  45.97,50.55 0 top
R6  9.91,28.52 270 top
R7  56.02,45.79 90 top
R8  11.43,15.06 180 top
R9  46.07,45.32 0 top
R10  17.53,35.56 0 top
R11  15.49,35.56 180 top
R12  13.46,35.56 0 top
R13  8.38,33.27 0 top
R14  10.41,33.27 180 top
R15  46.07,47.83 0 top
R16  52,28.1 90 top
R17  11.89,13.89 90 top
R18  52.1,33 270 top
R20  19.56,14.94 0 top
R21  19.56,13.92 0 top
R22  3.81,15.11 0 top
R23  3.81,16.13 0 top
R24  19.3,26.72 0 top
R34  16,34.16 270 top
R35  17.02,34.16 270 top
R36  8.89,31.88 270 top
R37  9.91,31.88 270 top
RN1  18.8,20.32 90 top
RN2  18.8,22.86 90 top
T1  11.4,50.3 0 top
U1  11.43,21.54 270 top
U2  52.71,49.23 270 top
Y1  11.43,11.36 180 top

### Tracks (layer width: path | path; a pad name or v marks a point on that pad's centre or on a via)
!INTN  (via drill 0.35)
  Top 0.152: 19.07,15.11 19.46,15.49 20.72,15.49 v21.46,14.76
  Top 0.203: R20.1 19.07,15.11 19.07,15.21 17.68,16.61 14.18,16.61 U1.36
  Bottom 0.152: JP2.2 22.07,14.76 v21.46,14.76
  Bottom 0.203: 21.97,15.24 JP2.2 22.1,15.26
!RESET  (via drill 0.35)
  Top 0.152: U1.37 17.89,18.79 v18.09,18.59 18.16,18.52 18.16,17.27 18.59,16.84 R2.1 | D2.A 18.54,24.52 18.54,24.51 v18.54,24.64 | C10.2 R2.1 | R2.1 20,15.92 v21.44,15.92
  Bottom 0.152: v18.54,24.64 18.54,19.05 v18.09,18.59 | JP3.2 21.63,15.92 v21.44,15.92
+3V3  (via drill 0.35)
  Top 0.2: 65,22.9 65,22.89 | U2.8 54.8,49.21
  Top 0.203: 20.04,14.22 R21.2
  Top 0.254: U1.28 10.18,16.28 9.3,15.39 C9.2 | R5.1 45.12,50.45 R15.1 R9.1 | R3.1 | 54.8,49.21 53.92,49.21 53.27,48.57 C18.2 53.27,42.42 53.4,42.3 | R7.1 56.02,42.42 55.9,42.3
  Top 0.3: RN2.2 RN2.3 | RN2.4 19.3,23.62
  Top 0.381: C22.1 20.54,29.72 L2.1 20.59,28.04 D1.A | 20.04,14.22 20.04,12.42 16,8.38 7.14,8.38 6.63,8.89 6.63,12.39 C9.2 | R20.2 20.04,14.22 | v20.7,14.1 20.17,14.1 20.04,14.22 | RN2.3 19.3,23.62 19.3,23.87 19.81,24.38 22.14,24.38 22.27,24.51 | 11.8,53.03 v11.8,49.7 | T1.13 8.66,53.03 11.8,53.03 | T1.11 16.78,53.13 11.9,53.13 11.8,53.03
  Top 0.406: J6.2 28.18,46.94 40.91,46.94 43.77,44.07 | R3.1 42.47,6.62 47.7,1.4 65.85,1.4 | R1.1 R3.1 | IC1.6 64.34,23.55 65,22.9 65.64,23.55 IC1.8 65.64,25.34 67.58,27.28 C21.2 68.58,28.62 69.88,29.92 69.88,41.32 68.7,42.5 67.17,42.5 PRESSURE1.2 65.36,44.3 65.36,47.1 | 65,22.89 IC1.2 65,20.27 72.4,12.86 72.4,11.66 | OLED.2 65.85,1.4 | 65.85,1.4 71.8,1.4 72.4,2 72.4,11.66 | J4.2 72.52,11.54 72.4,11.66 | 43.77,44.07 45.55,42.3 53.4,42.3 55.9,42.3 56.7,42.3 58.1,43.7 58.1,46.11 59.09,47.1 65.36,47.1 | 43.77,44.07 45.02,45.32 R9.1 | C19.2 66.8,46.6 66.3,47.1 65.36,47.1
  Top 0.508: D1.A 20.76,28.02 22.27,26.51 22.27,24.51 v22.27,18.29 20.82,16.84 R2.2
  Top 0.635: D1.A 20.56,31.16 C22.1 20.54,32.09 | 20.54,32.09 C17.2 | 20.54,32.09 22.82,32.09 23.75,33.02 23.75,39.12 21.8,41.06 v21.8,43.4 25.29,46.89 J6.2
  Bottom 0.381: v11.8,49.7 14.92,46.58 16.56,46.58 18.34,44.8 20.8,44.8 21.8,43.8 v21.8,43.4
  Bottom 0.508: v20.7,14.1 20.65,14.14 20.65,16.67 v22.27,18.29
+3V3A  (via drill 0.35, 0.35 pad 0.8)
  Top 0.254: U1.17 4.43,22.29 C5.2 | 4.83,23.29 U1.15 | 4.29,22.86 4.37,23.29 4.83,23.29 | U1.4 12.68,27.87 12.93,28.12 C3.2 12.93,29.69 12.95,29.72 v12.83,29.72 | U1.8 10.68,24.9 10.41,24.64 9.27,24.64 9.18,24.73 U1.11 9.18,26.89 8.64,27.43 C4.2 8.61,28.07 8.26,28.07 7.62,28.7 7.62,29.46 v7.37,29.72 | 4.83,23.29 v4.95,23.17 | U1.21 5.33,20.29 v4.99,19.95 4.68,19.63 C2.2
  Top 0.3: R10.2 18.14,35.43 v18.54,35.43
  Top 0.381: 4.29,25.74 C6.2 C1.2 4.29,22.86
  Top 0.559: 14.48,35.56 R12.2 | 14.48,35.56 R11.2 | v14.48,36.2 14.48,35.56
  Top 0.635: L2.2 18.73,29.72 v17.65,29.72 | C5.2 4.29,22.86 | 4.29,22.86 4.29,25.74 C23.1 4.57,26.53 4.57,26.92 v7.37,29.72 | v4.95,23.17 4.49,23.17 4.29,22.86
  Bottom 0.4: v17.65,29.72 19.81,31.88 19.81,34.16 v18.54,35.43 17.78,36.2 v14.48,36.2
  Bottom 0.635: v17.65,29.72 v12.83,29.72 v7.37,29.72 | v4.99,19.95 4.99,23.13 v4.95,23.17
+5V  (via drill 0.35)
  Top 0.2: FLOW.2 55.25,8.81 55.3,8.87
  Top 0.508: 55.3,8.87 v55.3,11.6
  Top 0.7: J1.1 21.29,6.86 22.8,8.37 29.83,8.37 | 29.83,8.37 37.67,16.2 44.5,16.2 46,17.7 46,32.5 47.69,34.19 J7.3 | 29.83,8.37 33.77,8.37 v33.8,8.4
  Bottom 0.508: v33.8,8.4 53.5,8.4 55.3,10.2 v55.3,11.6
ACTLED
  Top 0.254: U1.27 9.68,18.01 9.4,18.29 8.26,18.29 7.62,17.65 7.62,16.64 6.99,16 4.42,16 R23.2
ADDR
  Top 0.254: R4.1 49.65,50.23 U2.1
ALERT
  Top 0.254: R5.2 48.52,50.55 49.34,49.73 U2.2
BTNA  (via drill 0.35)
  Top 0.254: R18.2 52.45,31.7 v55.8,31.7 | J4.4 75.48,16.62 v74.7,17.4
  Top 0.406: J7.4 52.05,31.65 R18.2
  Bottom 0.254: v55.8,31.7 55.8,21.9 60.2,17.5 74.6,17.5 v74.7,17.4
BTNB  (via drill 0.35)
  Top 0.254: R16.2 54.05,29.05 v54.1,29.1 | v73.6,16.3 73.68,16.3 75.9,14.08 J4.3
  Top 0.406: J7.5 51.94,29.11 R16.2
  Bottom 0.254: v54.1,29.1 54.1,21.6 59.4,16.3 v73.6,16.3
CHGND  (via drill 0.35)
  other vias: 11.02,45.16 13.61,45.16 14.83,45.16 16.36,45.16 3.1,39.71 2.49,38.98 2.44,39.67 3.12,38.98
  pour Bottom (isolate 0.4, no thermals): 2.41,55.88 21.46,55.88 21.46,44.45 3.94,44.45 3.94,33.91 0,33.91 0,53.47
  pour Top (isolate 0.4, no thermals): 2.41,55.88 21.46,55.88 21.46,44.45 3.94,44.45 3.94,33.91 0,33.91 0,53.47
  pour Top: 10.72,45.62 16.51,45.62 17.32,44.5 10.31,44.4 10.06,44.91 10.16,45.06
FIO2
  Top 0.254: FIO2.2 71.47,47.85 70.58,48.73 U2.7
G-  (via drill 0.35)
  Top 0.254: v2.03,15.09 3.3,15.09 R22.1
  Bottom 0.254: v2.03,15.09 1.98,15.09 1.14,15.93 1.14,50.3 1.14,50.41 1.14,50.75 T1.14
GND  (via drill 0.35, 0.35 pad 0.4, 0.35 pad 0.6)
  Top 0.152: C10.1 19.3,18.52 RN1.1
  Top 0.2: OLED.1 64.35,10.05
  Top 0.203: 3.33,19.81 C2.1 C26.1 3.33,17.88 3.81,17.4 5.21,17.4 5.84,18.03 5.84,18.92 6.21,19.29 U1.23 | C1.1 3.33,22.23 | C5.1 3.33,21.08 | U1.19 8.46,21.29 v8.64,21.46
  Top 0.254: 3.33,19.81 3.33,21.08 3.33,22.23 | v5.33,24.13 5.67,23.79 U1.14 7.96,23.79 8.13,23.62 8.13,22.99 8,22.86 7.82,22.79 U1.16 | C1.1 3.1,23.82 2.67,24.26 v2.67,24.51 3.33,25.17 C6.1 2.96,25.59 C23.2 | 10.68,16.51 U1.29 10.61,17.02 10.61,15.84 10.26,15.49 C9.1 | C11.1 12.95,32.26 13.89,31.32 C3.1 13.89,28.25 13.21,27.56 13.21,26.02 U1.3 13.18,24.67 13.56,24.29 U1.48 | 8.64,30.1 C4.1 R6.1 9.96,28.96 10.41,28.96 10.67,28.7 10.67,27.69 10.18,27.2 U1.9 | C21.1 65.92,28.62 v65,27.7 | v65,27.7 IC1.7 | IC1.1 65.64,21.41 68.35,18.7 v68.4,18.7 | R4.2 45.09,52.83 43.92,52.83 43.9,52.8 v42.4,52.8 | IC1.5 63.7,26.39 v65,27.7 | v53.7,11.6 53.75,11.55 FLOW.1 | 64.35,10.05 64.3,10.1 v64.3,11.2 | C18.1 v49.7,45.3 | U2.3 48.47,49.23 v48.4,49.3
  Top 0.3: C17.1 18.84,31.84 C22.2
  Top 0.381: U1.23 10.05,19.29 10.68,18.66 10.68,16.51 | 19.3,21.08 RN2.1 | 19.3,21.08 RN1.1 | v20.32,21.11 20.29,21.08 19.3,21.08
  Top 0.406: v69.8,46.6 C19.1 | PRESSURE1.1 C19.1 | R16.1 v52,24.6 | v52.1,36.3 R18.1 | J4.1 v74.7,9 | v73,44.5 73,46.35 FIO2.1
  Top 0.508: C19.1
  Bottom 0.203: 23.06,23.47 21.37,23.47 v20.32,22.41 v20.32,21.11
  Bottom 0.254: v5.33,24.13 4.95,24.51 v2.67,24.51
  other vias: 2.57,22.28 2.57,23.38 2.57,18.89 2.79,17.27 4.19,17.27 5.46,17.27 6.6,17.27 11.94,33.53 20.57,35.69 22.48,33.66 21.08,33.25 5.23,35.34 5.27,33.09 5.22,34.23 17.65,28.19 17.65,26.67 15.75,27.05 15.75,25.15 16.38,17.91 13.97,9.27 8.76,9.27 12.45,9.27 3.45,28.7 2.41,28.68 5.67,31.66 3.58,30.71 4.67,30.71 4.5,31.67 11.43,21.59 14.35,21.59 11.68,24.38 11.56,18.54 2.46,31.67 3.48,31.66 4.67,29.74 5.33,25.27 7.62,26.29 6.35,26.29 15.75,26.04 14.86,10.79 14.86,11.94 14.86,12.95 17.65,13.08 21.84,30.23 21.84,29.21 21.84,28.19 10.79,27.43 3.46,29.74 4.66,28.71 10.16,13.84 8.89,12.32 10.67,9.27 8.89,23.24 13.72,24.26 10.03,19.18 6.86,27.69 6.48,14.1 5.46,14.1 4.19,14.1 2.67,14.1 13.21,13.84 3.81,10.92 3.81,9.14 3.81,6.6 5.33,6.6 17.27,11.18 20.42,10.97 18.95,9.3 18.03,8.43 6.86,6.6 7.69,38.73 9.56,38.42 8.94,37.8 15.96,38.63 15.26,37.91 14.19,37.25 12.31,37.13 11.23,37.12 21.58,39.51 20.49,43.05 20.53,42.03 20.48,40.83 20.43,39.52 17.65,25.4 18.58,34.17 18.67,33.15 17.78,31.88 15.24,31.75 14.22,34.54 14.22,33.4 14.22,32.26 12.95,32.77 12.95,31.37 11.94,31.37 11.94,35.05 6.99,35.31 6.99,33.15 6.99,31.62 11.94,32.38 6.22,30.23 11.94,36.2 9.27,28.83 10.67,28.83 15.24,30.61 13.97,30.61 17.78,30.99 21.08,11.81 22.78,42.29 23.54,42.29 23.54,40.76 22.78,41.53 23.54,41.53 23.29,25.76 23.31,24.9 21.23,18.42 22.58,10.74 21.31,23.48 23.13,43.08 15.11,37.06
  pour Bottom (isolate 0.254, no thermals): 7.32,39.07 24.08,39.07 24.08,9.55 20.32,5.79 1.98,5.79 0.25,7.52 0.25,32.92 4.57,32.92 4.57,35.86 7.32,35.86
  pour Top (isolate 0.3, no thermals): 7.32,39.07 23.52,39.01 24.08,38.46 24.08,9.6 20.22,5.74 2.03,5.74 0.25,7.52 0.25,32.92 4.57,32.92 4.57,35.86 7.32,35.86
  pour Top (isolate 0.3, no thermals): 20.07,43.7 23.86,43.7 23.86,42.68 29.44,42.68 29.44,40.61 24.05,40.61 24.05,40.62 23.81,40.62 23.81,38.15 19.93,38.15 19.93,43.67 19.95,43.69 20.08,43.69
  pour Bottom (no thermals): 19.95,43.71 24.11,43.71 24.11,42.69 26.44,42.69 26.44,40.61 24.07,40.61 24.07,38.13 19.94,38.13 19.94,43.72
  pour Bottom (rank 2): 20.3,5.8 23.5,2.6 23.5,0 82.1,0 85,2.9 85,51.4 80.4,56 21.3,56 19.7,54.4 19.7,6.4
LINKLED
  Top 0.254: U1.25 8.64,17.05 8.64,16.51 7.24,15.11 R22.2
MISO  (via drill 0.35)
  Top 0.203: U1.34 13.28,16.99 13.28,16.19 14.1,15.37 16.76,15.37 17.27,14.86
  Top 0.508: v17.4,14.86 17.27,14.86
  Bottom 0.203: v17.4,14.86 17.53,14.86 18.29,15.62 18.29,16.38 20.95,19.05 28.04,19.05 J6.13
MOSI  (via drill 0.35)
  Top 0.203: U1.35 13.68,16.29 14.1,15.88 v17.4,15.88
  Bottom 0.203: v17.4,15.88 17.4,16.13 22.76,21.49 J6.12
N$1
  Top 0.152: 15.94,21.84 U1.43 16,21.91 17.26,21.91 17.96,22.61 RN2.7
N$2
  Top 0.152: 15.94,22.35 U1.44 16.95,22.29 17.78,23.11 RN2.6
N$3
  Top 0.152: U1.45 16.69,22.79 17.53,23.62 18.26,23.62 RN2.5
N$4  (via drill 0.35)
  Top 0.152: D2.C 20.8,25.56 v20.8,26.6 20.8,26.7
  Bottom 0.152: v20.8,26.6 21.79,27.59 22.09,27.59 24.6,30.09 24.6,45.89 J6.1
N$5
  Top 0.152: U1.38 15.89,19.3 17.53,19.3 17.74,19.52 RN1.8
N$6
  Top 0.152: U1.39 15.9,19.81 17.53,19.81 17.78,20.07 RN1.7
N$7
  Top 0.152: U1.40 15.91,20.32 17.53,20.32 17.78,20.57 RN1.6
N$8
  Top 0.152: U1.41 15.92,20.83 17.53,20.83 17.82,21.12 RN1.5
N$9
  Top 0.152: U1.42 15.93,21.34 17.53,21.34 18.25,22.06 RN2.8
N$11
  Top 0.152: 12.62,11.99 Y1.1
  Top 0.254: C8.2 13.44,11.4 Y1.1 11.89,12.95 R17.1
N$12
  Top 0.254: U1.20 5.08,20.79 C16.1
N$13
  cutout Top: 15.62,32.51 17.4,32.51 17.4,30.35 16.89,29.84 15.75,29.84 15.62,29.97
N$14
  cutout Top: 19.3,38.99 17.4,37.08 17.4,36.45 17.27,36.32 15.62,36.32 15.49,36.45 15.49,37.47 17.27,39.24 18.92,39.24 18.92,38.73
N$15
  Top 0.254: U1.22 5.95,19.79 5.33,19.18 5.33,18.54 5.03,18.24 C26.2
N$17
  Top 0.254: U1.10 9.68,27.82 R6.2
N$20
  Top 0.152: 19.07,27.75 D1.C
  Top 0.254: D1.C 19.79,26.78 R24.2
N$22
  Top 0.254: 11.68,15.29 R8.1 11.91,14.48 | U1.31 11.68,15.29 | 11.68,15.29 11.68,14.71 11.91,14.48 | R17.2 11.99,14.4 11.91,14.48
N$24  (via drill 0.35)
  Top 0.254: v44.4,23.9 29.73,23.9 28.64,22.81 25.71,22.81 24.6,21.7 24.6,13.5 v24.1,13
  Bottom 0.203: JP1.1 24.07,13.03 v24.1,13
  Bottom 0.254: J7.7 44.53,24.03 v44.4,23.9
N$25  (via drill 0.35)
  Top 0.254: v44.4,21.4 29.77,21.4 28.64,20.27 26.77,20.27 25.4,18.9 v25.4,14.8
  Bottom 0.203: JP2.1 25.33,14.73 v25.4,14.8
  Bottom 0.254: J7.8 44.49,21.49 v44.4,21.4
N$26  (via drill 0.35)
  Top 0.254: v44.5,18.9 29.81,18.9 28.64,17.73 26.73,17.73 26.2,17.2 v26.2,16.4
  Bottom 0.203: JP3.1 26.18,16.38 v26.2,16.4
  Bottom 0.254: J7.9 44.55,18.95 v44.5,18.9
N$29
  Top 0.152: Y1.3 10.18,10.44 9.81,10.18
  Top 0.254: C7.2 10.06,10.44 10.18,10.44 | U1.30 11.18,15.37 | Y1.3 11.18,11.53 11.18,11.54 11.18,15.29 | 11.18,15.36 11.18,15.37 | R8.2 11.18,15.29 | 11.18,15.29 11.18,15.37
N$38
  Top 0.254: U2.6 55.42,48.23 56.02,47.63 R7.2
N$40
  Top 0.2: 47.02,45.42 R9.2
  Top 0.254: U2.5 49.83,48.23 47.02,45.42
N$45
  Top 0.254: U2.4 49.43,48.73 48.53,47.83 R15.2
N$55
  cutout Top: 23.75,17.27 24.26,17.27 24.38,17.14 24.38,10.67 24,10.29 22.94,10.29 22.94,11.3 23.62,11.3 23.75,11.43
N$56
  cutout Top: 19.05,30.48 20.19,30.48 20.19,27.56 19.43,27.56 19.05,27.94
N$80
  cutout Top: 17.27,29.21 14.73,26.67 13.46,26.67 13.46,27.69 15.75,29.97
N$82
  cutout Top: 8.38,35.05 10.41,35.05 10.41,30.23 8.38,30.23
N$83
  cutout Top: 15.24,36.2 17.83,36.2 17.83,32.51 15.24,32.51
N$84
  cutout Top: 7.49,36.25 10.67,36.25 10.67,33.15 7.49,33.15
R_N
  Top 0.3: R37.2 9.62,31.09 9.62,30.7 9.87,30.45 10.81,30.45 12.18,29.09 U1.5
R_P
  Top 0.3: R36.2 9.17,31.14 9.17,30.51 9.69,30 10.62,30 11.68,28.95 11.68,27.02 | U1.6 11.68,27.02 | 11.68,27.02
RCT  (via drill 0.35)
  Top 0.3: v7.85,32.46 7.87,32.49 7.9,32.49 R13.1 7.98,33.33 C14.2 7.98,37.8 9.95,39.78 13.06,39.78 14.57,41.29 T1.3 | R14.1 10.88,33.26 v10.88,32.46
  Bottom 0.3: v7.85,32.46 v10.88,32.46 10.97,32.46
RD+
  Top 0.3: C12.2 8.89,35.79 9.17,36.07 9.17,36.92 10.83,38.58 14.31,38.58 15.49,39.76 17.08,39.76 18.38,41.06 18.38,42.78 18.26,42.9 17.1,42.9 16.9,42.7 16.9,41.62 T1.1
RD-
  Top 0.3: C13.2 9.91,35.79 9.62,36.07 9.62,36.74 11.02,38.13 14.5,38.13 15.68,39.31 17.27,39.31 18.83,40.87 18.83,42.97 18.45,43.35 16.44,43.35 T1.2
RX_N
  Top 0.3: R14.2 9.93,32.38 R37.1
  Top 0.5: R37.1 C13.1
RX_P
  Top 0.3: R13.2 8.87,32.38 R36.1
  Top 0.5: R36.1 C12.1
SCL  (via drill 0.35)
  Top 0.152: 44.38,13.87 R1.2 | J7.11
  Top 0.2: v58.31,14.02 58.3,14 | FLOW.4 58.25,8.85 58.3,8.9
  Top 0.254: R1.2 J7.11 | v58.31,14.02 57.06,15.27 52.06,15.27 50.66,13.87 J7.11 | 58.3,8.9 58.3,14 | OLED.4 68.85,12.95 v68.9,13 67.3,14.6 65.4,14.6 62.99,17 62.99,21.3 IC1.4 63.7,22.5 62.67,23.53 62.67,24.09 57.8,28.95 57.8,41.58 60.35,44.13 PRESSURE1.4 60.35,45.76 v60.4,45.8 | U2.10 56.13,50.23 56.5,50.6 v60.4,50.6
  Bottom 0.254: v58.31,14.02 58.33,14 67.9,14 v68.9,13 | v60.4,45.8 v60.4,50.6
SCLK  (via drill 0.35)
  Top 0.203: U1.33 12.68,16.28 14.1,14.86 15.75,14.86 16,14.61 v16.38,14.61
  Bottom 0.203: v16.38,14.61 16.38,15.88 24.54,24.03 J6.11
SCSN  (via drill 0.35)
  Top 0.152: 19.07,13.69 19.07,13.84 R21.1
  Top 0.203: U1.32 12.18,16.27 14.1,14.35 15.37,14.35 15.88,13.84 19.07,13.84 | R21.1 18.92,13.77 v18.92,13.08
  Bottom 0.203: JP1.2 22.3,13.03 22.25,13.08 v18.92,13.08
SDA  (via drill 0.35)
  Top 0.152: 48.31,11.18 J7.12
  Top 0.2: 64.32,22.03 IC1.3 | 67.3,3.6 67.3,3.8 67.35,3.85 OLED.3 | FLOW.3 56.75,8.95 56.8,9
  Top 0.254: R3.2 48.31,11.18 | J7.12 50.46,11.33 52.66,13.53 56.07,13.53 56.8,12.8 v56.8,12 56.8,9 | 64.32,22.03 64.32,22.56 63.22,23.66 63.22,24.34 58.5,29.05 58.5,41.23 59.8,42.53 61.2,42.53 PRESSURE1.3 v62.9,45.8 | v67.4,12.1 67.35,12.05 OLED.3 | IC1.3 64.34,21.41 63.84,20.91 63.84,17.5 65.85,15.5 67.8,15.5 70.7,12.6 70.7,2.5 70.6,2.4 68.5,2.4 67.3,3.6 | U2.9 62.87,49.73 v62.9,49.7
  Bottom 0.2: 56.9,12.1 v56.8,12
  Bottom 0.254: v67.4,12.1 56.9,12.1 | v62.9,45.8 v62.9,49.7
T_N
  Top 0.3: R35.2 16.74,33.4 16.74,29.57 14.14,26.98 14.14,26.02 U1.1
T_P
  Top 0.152: R34.2 16.15,33.68
  Top 0.3: R34.2 16.28,33.4 16.28,29.76 13.69,27.17 13.69,26 U1.2
TCT  (via drill 0.35)
  Top 0.3: R12.1 12.98,36.12 12.95,36.14
  Top 0.559: v13.34,36.52 12.95,36.14 C11.2
  Bottom 0.3: v13.34,36.52 13.34,43.92 T1.4
TD+
  Top 0.152: 16.67,46.1 16.89,45.89
  Top 0.3: R34.1 16,35.53 R11.1 15.98,36.14 16.28,36.45 16.28,37.69 19.28,40.68 19.28,43.49 16.89,45.89 16.62,46.15 13.1,46.15 12.3,45.35 12.3,44.37 12.3,43.3 11.6,42.6 11.6,41.84 T1.5
TD-
  Top 0.3: R35.1 17.02,35.53 R10.1 17.04,36.14 16.74,36.45 16.74,37.5 19.78,40.54 19.78,43.73 16.91,46.6 12.9,46.6 11.85,45.55 11.85,43.49 11.28,42.92 10.77,43.44 T1.6
V+
  Top 0.762: T1.9 5.97,40.42 J3.2
V-
  Top 0.762: J3.1 4.22,38 4.22,42.48 T1.10
Y-  (via drill 0.35)
  Top 0.254: v2.08,16.15 2.11,16.13 R23.1
  Bottom 0.254: v2.08,16.15 1.63,16.61 1.63,50.09 4.5,52.97 14.07,52.97 T1.12

### Text on the board
tPlace: FiO2 | DIFF PRESSURE | TEMP and / HUMIDITY | VentMon T0.4 | based on ETHERNET FEATHER WING v0.1 by Particle | I2C | FLOW SENSOR
bPlace: VentMon T0.4 | Public Invention | based on / ETHERNET FEATHER WING v0.1 / by Particle